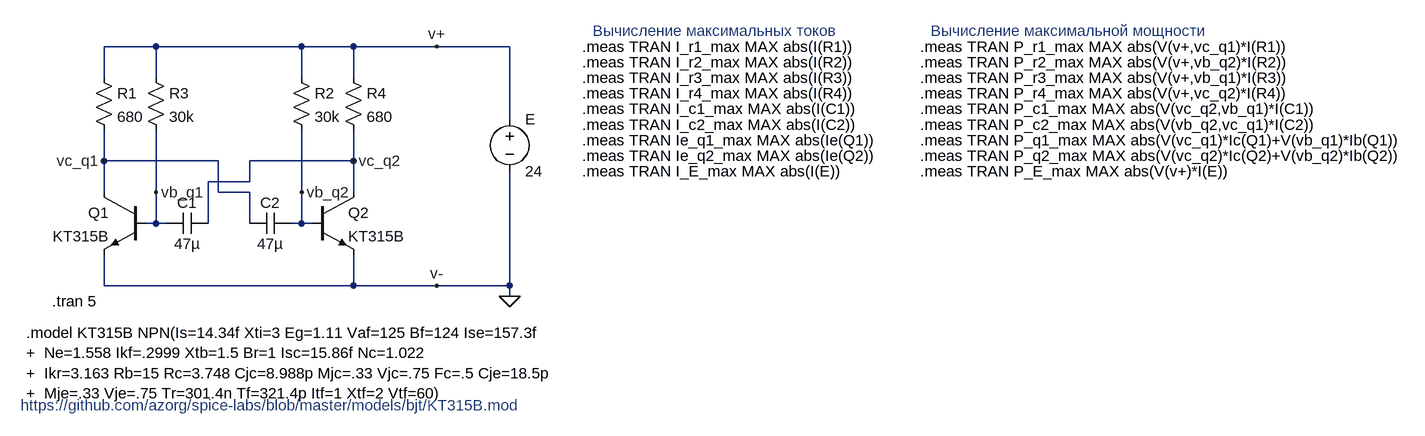
[diagram p0: schematic sheme.asc]
sheme.asc, the LTspice schematic file:
Version 4
SHEET 1 2168 680
WIRE 176 16 96 16
WIRE 400 16 176 16
WIRE 480 16 400 16
WIRE 608 16 480 16
WIRE 720 16 608 16
WIRE 96 64 96 16
WIRE 176 64 176 16
WIRE 400 64 400 16
WIRE 480 64 480 16
WIRE 720 128 720 16
WIRE 96 192 96 144
WIRE 272 192 96 192
WIRE 480 192 480 144
WIRE 480 192 320 192
WIRE 320 224 320 192
WIRE 320 224 256 224
WIRE 96 240 96 192
WIRE 176 240 176 144
WIRE 272 240 272 192
WIRE 320 240 272 240
WIRE 400 240 400 144
WIRE 480 240 480 192
WIRE 176 288 176 240
WIRE 176 288 160 288
WIRE 192 288 176 288
WIRE 256 288 256 224
WIRE 320 288 320 240
WIRE 400 288 400 240
WIRE 400 288 384 288
WIRE 416 288 400 288
WIRE 96 384 96 336
WIRE 480 384 480 336
WIRE 480 384 96 384
WIRE 608 384 480 384
WIRE 720 384 720 208
WIRE 720 384 608 384
WIRE 720 400 720 384
FLAG 720 400 0
FLAG 608 16 v+
FLAG 608 384 v-
FLAG 96 192 vc_q1
FLAG 480 192 vc_q2
FLAG 176 240 vb_q1
FLAG 400 240 vb_q2
SYMBOL voltage 720 112 R0
WINDOW 123 0 0 Left 0
WINDOW 39 0 0 Left 0
SYMATTR InstName E
SYMATTR Value 24
SYMBOL res 160 48 R0
SYMATTR InstName R3
SYMATTR Value 30k
SYMBOL res 384 48 R0
SYMATTR InstName R2
SYMATTR Value 30k
SYMBOL res 464 48 R0
SYMATTR InstName R4
SYMATTR Value 680
SYMBOL res 80 48 R0
SYMATTR InstName R1
SYMATTR Value 680
SYMBOL cap 256 272 R90
WINDOW 0 0 32 VBottom 2
WINDOW 3 32 32 VTop 2
SYMATTR InstName C1
SYMATTR Value 47µ
SYMBOL cap 384 272 R90
WINDOW 0 0 32 VBottom 2
WINDOW 3 32 32 VTop 2
SYMATTR InstName C2
SYMATTR Value 47µ
SYMBOL npn 160 240 M0
SYMATTR InstName Q1
SYMATTR Value KT315B
SYMBOL npn 416 240 R0
SYMATTR InstName Q2
SYMATTR Value KT315B
TEXT 16 408 Left 2 !.tran 5
TEXT -24 456 Left 2 !.model KT315B NPN(Is=14.34f Xti=3 Eg=1.11 Vaf=125 Bf=124 Ise=157.3f\n+  Ne=1.558 Ikf=.2999 Xtb=1.5 Br=1 Isc=15.86f Nc=1.022\n+  Ikr=3.163 Rb=15 Rc=3.748 Cjc=8.988p Mjc=.33 Vjc=.75 Fc=.5 Cje=18.5p\n+  Mje=.33 Vje=.75 Tr=301.4n Tf=321.4p Itf=1 Xtf=2 Vtf=60)
TEXT -32 568 Left 2 ;https://github.com/azorg/spice-labs/blob/master/models/bjt/KT315B.mod
TEXT 832 16 Left 2 !.meas TRAN I_r1_max MAX abs(I(R1))
TEXT 832 40 Left 2 !.meas TRAN I_r2_max MAX abs(I(R2))
TEXT 832 64 Left 2 !.meas TRAN I_r3_max MAX abs(I(R3))
TEXT 832 88 Left 2 !.meas TRAN I_r4_max MAX abs(I(R4))
TEXT 832 112 Left 2 !.meas TRAN I_c1_max MAX abs(I(C1))
TEXT 832 136 Left 2 !.meas TRAN I_c2_max MAX abs(I(C2))
TEXT 848 -8 Left 2 ;Вычисление максимальных токов
TEXT 1368 -8 Left 2 ;Вычисление максимальной мощности
TEXT 832 160 Left 2 !.meas TRAN Ie_q1_max MAX abs(Ie(Q1))
TEXT 832 184 Left 2 !.meas TRAN Ie_q2_max MAX abs(Ie(Q2))
TEXT 1352 16 Left 2 !.meas TRAN P_r1_max MAX abs(V(v+,vc_q1)*I(R1))
TEXT 832 208 Left 2 !.meas TRAN I_E_max MAX abs(I(E))
TEXT 1352 40 Left 2 !.meas TRAN P_r2_max MAX abs(V(v+,vb_q2)*I(R2))
TEXT 1352 64 Left 2 !.meas TRAN P_r3_max MAX abs(V(v+,vb_q1)*I(R3))
TEXT 1352 88 Left 2 !.meas TRAN P_r4_max MAX abs(V(v+,vc_q2)*I(R4))
TEXT 1352 112 Left 2 !.meas TRAN P_c1_max MAX abs(V(vc_q2,vb_q1)*I(C1))
TEXT 1352 136 Left 2 !.meas TRAN P_c2_max MAX abs(V(vb_q2,vc_q1)*I(C2))
TEXT 1352 160 Left 2 !.meas TRAN P_q1_max MAX abs(V(vc_q1)*Ic(Q1)+V(vb_q1)*Ib(Q1))
TEXT 1352 184 Left 2 !.meas TRAN P_q2_max MAX abs(V(vc_q2)*Ic(Q2)+V(vb_q2)*Ib(Q2))
TEXT 1352 208 Left 2 !.meas TRAN P_E_max MAX abs(V(v+)*I(E))

The netlist it stands for:
* sheme.asc
V§E v+ 0 24
R3 v+ vb_q1 30k
R2 v+ vb_q2 30k
R4 v+ vc_q2 680
R1 v+ vc_q1 680
C1 vc_q2 vb_q1 47µ
C2 vb_q2 vc_q1 47µ
Q1 vc_q1 vb_q1 0 0 KT315B
Q2 vc_q2 vb_q2 0 0 KT315B
.model NPN NPN
.model PNP PNP
.lib standard.bjt
.tran 5
.model KT315B NPN(Is=14.34f Xti=3 Eg=1.11 Vaf=125 Bf=124 Ise=157.3f
+  Ne=1.558 Ikf=.2999 Xtb=1.5 Br=1 Isc=15.86f Nc=1.022
+  Ikr=3.163 Rb=15 Rc=3.748 Cjc=8.988p Mjc=.33 Vjc=.75 Fc=.5 Cje=18.5p
+  Mje=.33 Vje=.75 Tr=301.4n Tf=321.4p Itf=1 Xtf=2 Vtf=60)
* https://github.com/azorg/spice-labs/blob/master/models/bjt/KT315B.mod
.meas TRAN I_r1_max MAX abs(I(R1))
.meas TRAN I_r2_max MAX abs(I(R2))
.meas TRAN I_r3_max MAX abs(I(R3))
.meas TRAN I_r4_max MAX abs(I(R4))
.meas TRAN I_c1_max MAX abs(I(C1))
.meas TRAN I_c2_max MAX abs(I(C2))
* Вычисление максимальных токов
* Вычисление максимальной мощности
.meas TRAN Ie_q1_max MAX abs(Ie(Q1))
.meas TRAN Ie_q2_max MAX abs(Ie(Q2))
.meas TRAN P_r1_max MAX abs(V(v+,vc_q1)*I(R1))
.meas TRAN I_E_max MAX abs(I(E))
.meas TRAN P_r2_max MAX abs(V(v+,vb_q2)*I(R2))
.meas TRAN P_r3_max MAX abs(V(v+,vb_q1)*I(R3))
.meas TRAN P_r4_max MAX abs(V(v+,vc_q2)*I(R4))
.meas TRAN P_c1_max MAX abs(V(vc_q2,vb_q1)*I(C1))
.meas TRAN P_c2_max MAX abs(V(vb_q2,vc_q1)*I(C2))
.meas TRAN P_q1_max MAX abs(V(vc_q1)*Ic(Q1)+V(vb_q1)*Ib(Q1))
.meas TRAN P_q2_max MAX abs(V(vc_q2)*Ic(Q2)+V(vb_q2)*Ib(Q2))
.meas TRAN P_E_max MAX abs(V(v+)*I(E))
.backanno
.end